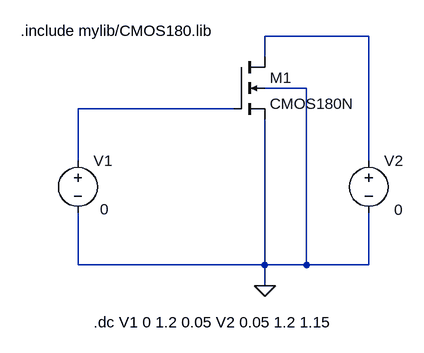
[diagram p0: schematic Tutorial_20220305.asc]
Tutorial_20220305.asc, the LTspice schematic file:
Version 4
SHEET 1 880 680
WIRE 288 -48 128 -48
WIRE 128 -16 128 -48
WIRE 192 32 128 32
WIRE 80 64 -160 64
WIRE -160 144 -160 64
WIRE 288 144 288 -48
WIRE -160 304 -160 224
WIRE 128 304 128 80
WIRE 128 304 -160 304
WIRE 192 304 192 32
WIRE 192 304 128 304
WIRE 288 304 288 224
WIRE 288 304 192 304
WIRE 128 336 128 304
FLAG 128 336 0
SYMBOL nmos4 80 -16 R0
SYMATTR InstName M1
SYMATTR Value CMOS180N
SYMATTR Value2 l=0.18u w=1u
SYMBOL voltage -160 128 R0
WINDOW 3 34 90 Left 2
WINDOW 123 0 0 Left 0
WINDOW 39 0 0 Left 0
SYMATTR InstName V1
SYMATTR Value 0
SYMBOL voltage 288 128 R0
WINDOW 3 39 91 Left 2
WINDOW 123 0 0 Left 0
WINDOW 39 0 0 Left 0
SYMATTR InstName V2
SYMATTR Value 0
TEXT -248 -56 Left 2 !.include mylib/CMOS180.lib
TEXT -136 392 Left 2 !.dc V1 0 1.2 0.05 V2 0.05 1.2 1.15

The netlist it stands for:
* Tutorial_20220305.asc
M1 N001 N002 0 0 CMOS180N l=0.18u w=1u
V1 N002 0 0
V2 N001 0 0
.model NMOS NMOS
.model PMOS PMOS
.lib standard.mos
.include mylib/CMOS180.lib
.dc V1 0 1.2 0.05 V2 0.05 1.2 1.15
.backanno
.end